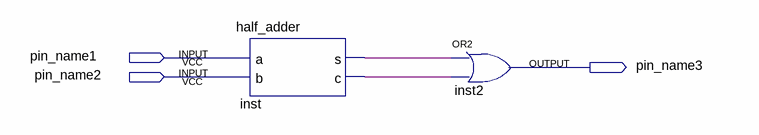
[diagram p0: schematic sheet]
// Quartus schematic testor.bdf as structural Verilog: 2 symbols, 3 pins
module testor (
  input  pin_name1,
  input  pin_name2,
  output pin_name3
);

  wire inst_c, inst_s;

  half_adder inst (.a(pin_name1), .b(pin_name2), .s(inst_s), .c(inst_c));
  or inst2 (pin_name3, inst_s, inst_c);
endmodule
